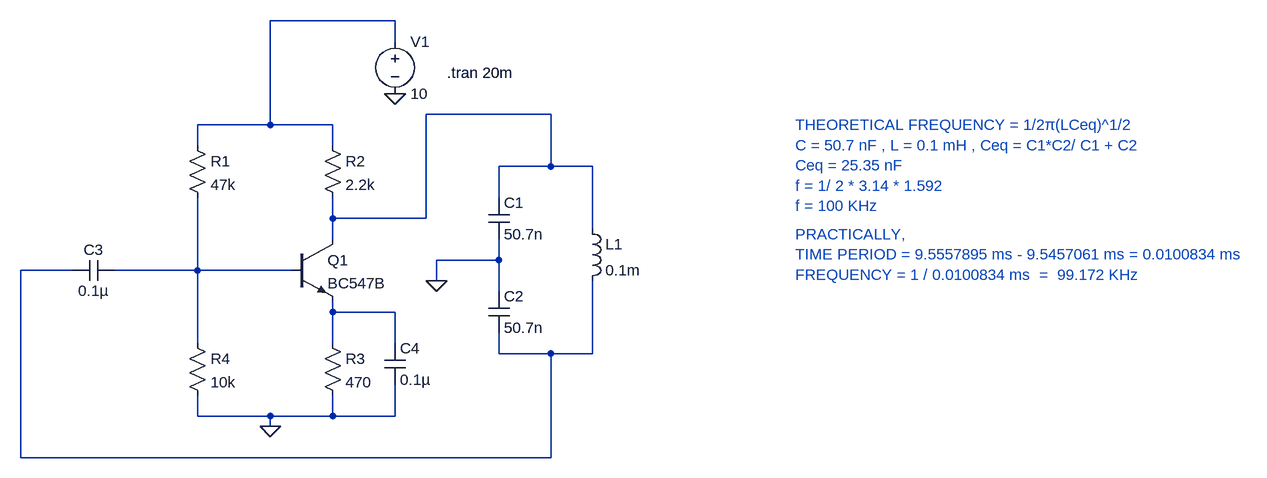
[diagram p0: schematic Colpitt_OSC.asc]
Colpitt_OSC.asc, the LTspice schematic file:
Version 4
SHEET 1 1760 680
WIRE 400 -160 208 -160
WIRE 400 -128 400 -160
WIRE 640 -16 448 -16
WIRE 208 0 208 -160
WIRE 208 0 96 0
WIRE 304 0 208 0
WIRE 96 32 96 0
WIRE 304 32 304 0
WIRE 640 64 640 -16
WIRE 640 64 560 64
WIRE 704 64 640 64
WIRE 560 112 560 64
WIRE 304 144 304 112
WIRE 448 144 448 -16
WIRE 448 144 304 144
WIRE 704 160 704 64
WIRE 304 176 304 144
WIRE 560 208 560 176
WIRE 560 208 464 208
WIRE -96 224 -176 224
WIRE 96 224 96 112
WIRE 96 224 -32 224
WIRE 240 224 96 224
WIRE 464 240 464 208
WIRE 560 256 560 208
WIRE 304 288 304 272
WIRE 400 288 304 288
WIRE 96 336 96 224
WIRE 304 336 304 288
WIRE 400 336 400 288
WIRE 560 352 560 320
WIRE 640 352 560 352
WIRE 704 352 704 240
WIRE 704 352 640 352
WIRE 96 448 96 416
WIRE 208 448 96 448
WIRE 304 448 304 416
WIRE 304 448 208 448
WIRE 400 448 400 400
WIRE 400 448 304 448
WIRE 208 464 208 448
WIRE -176 512 -176 224
WIRE 640 512 640 352
WIRE 640 512 -176 512
FLAG 208 464 0
FLAG 464 240 0
FLAG 400 -48 0
SYMBOL res 80 16 R0
SYMATTR InstName R1
SYMATTR Value 47k
SYMBOL res 288 16 R0
SYMATTR InstName R2
SYMATTR Value 2.2k
SYMBOL res 288 320 R0
SYMATTR InstName R3
SYMATTR Value 470
SYMBOL res 80 320 R0
SYMATTR InstName R4
SYMATTR Value 10k
SYMBOL npn 240 176 R0
SYMATTR InstName Q1
SYMATTR Value BC547B
SYMBOL cap 544 112 R0
SYMATTR InstName C1
SYMATTR Value 50.7n
SYMBOL cap 544 256 R0
SYMATTR InstName C2
SYMATTR Value 50.7n
SYMBOL ind 688 144 R0
SYMATTR InstName L1
SYMATTR Value 0.1m
SYMBOL cap -32 208 R90
WINDOW 0 0 32 VBottom 2
WINDOW 3 32 32 VTop 2
SYMATTR InstName C3
SYMATTR Value 0.1µ
SYMBOL voltage 400 -144 R0
WINDOW 123 0 0 Left 0
WINDOW 39 0 0 Left 0
SYMATTR InstName V1
SYMATTR Value 10
SYMBOL cap 384 336 R0
SYMATTR InstName C4
SYMATTR Value 0.1µ
TEXT 480 -80 Left 2 !.tran 20m
TEXT 1016 0 Left 2 ;THEORETICAL FREQUENCY = 1/2π(LCeq)^1/2\nC = 50.7 nF , L = 0.1 mH , Ceq = C1*C2/ C1 + C2\nCeq = 25.35 nF\nf = 1/ 2 * 3.14 * 1.592\nf = 100 KHz
TEXT 1016 168 Left 2 ;PRACTICALLY,\nTIME PERIOD = 9.5557895 ms - 9.5457061 ms = 0.0100834 ms\nFREQUENCY = 1 / 0.0100834 ms  =  99.172 KHz

The netlist it stands for:
* Colpitt_OSC.asc
R1 N001 N004 47k
R2 N001 N002 2.2k
R3 N005 0 470
R4 N004 0 10k
Q1 N002 N004 N005 0 BC547B
C1 N002 0 50.7n
C2 0 N003 50.7n
L1 N002 N003 0.1m
C3 N004 N003 0.1µ
V1 N001 0 10
C4 N005 0 0.1µ
.model NPN NPN
.model PNP PNP
.lib standard.bjt
.tran 20m
* THEORETICAL FREQUENCY = 1/2π(LCeq)^1/2
* C = 50.7 nF , L = 0.1 mH , Ceq = C1*C2/ C1 + C2
* Ceq = 25.35 nF
* f = 1/ 2 * 3.14 * 1.592
* f = 100 KHz
* PRACTICALLY,
* TIME PERIOD = 9.5557895 ms - 9.5457061 ms = 0.0100834 ms
* FREQUENCY = 1 / 0.0100834 ms  =  99.172 KHz
.backanno
.end